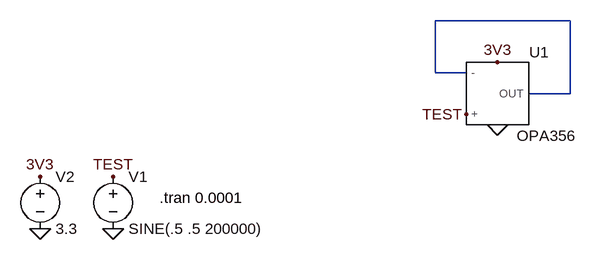
[diagram p0: schematic OPA356.asc]
OPA356.asc, the LTspice schematic file:
Version 4
SHEET 1 880 680
WIRE 528 192 320 192
WIRE 320 272 320 192
WIRE 368 272 320 272
WIRE 528 304 528 192
WIRE 528 304 464 304
FLAG -288 512 0
FLAG -176 512 0
FLAG 416 352 0
FLAG -288 432 3V3
FLAG -176 432 TEST
FLAG 416 256 3V3
FLAG 368 336 TEST
SYMBOL voltage -176 416 R0
WINDOW 123 0 0 Left 2
WINDOW 39 0 0 Left 2
SYMATTR InstName V1
SYMATTR Value SINE(.5 .5 200000)
SYMBOL voltage -288 416 R0
WINDOW 123 0 0 Left 2
WINDOW 39 0 0 Left 2
SYMATTR InstName V2
SYMATTR Value 3.3
SYMBOL AutoGenerated\\OPA356 416 304 R0
SYMATTR InstName U1
TEXT -104 464 Left 2 !.tran 0.0001

The netlist it stands for:
* OPA356.asc
V1 TEST 0 SINE(.5 .5 200000)
V2 3V3 0 3.3
XU1 N001 0 TEST N001 3V3 OPA356  ; pins OUT -V + - +V
.tran 0.0001
.lib OPA356.LIB
.backanno
.end